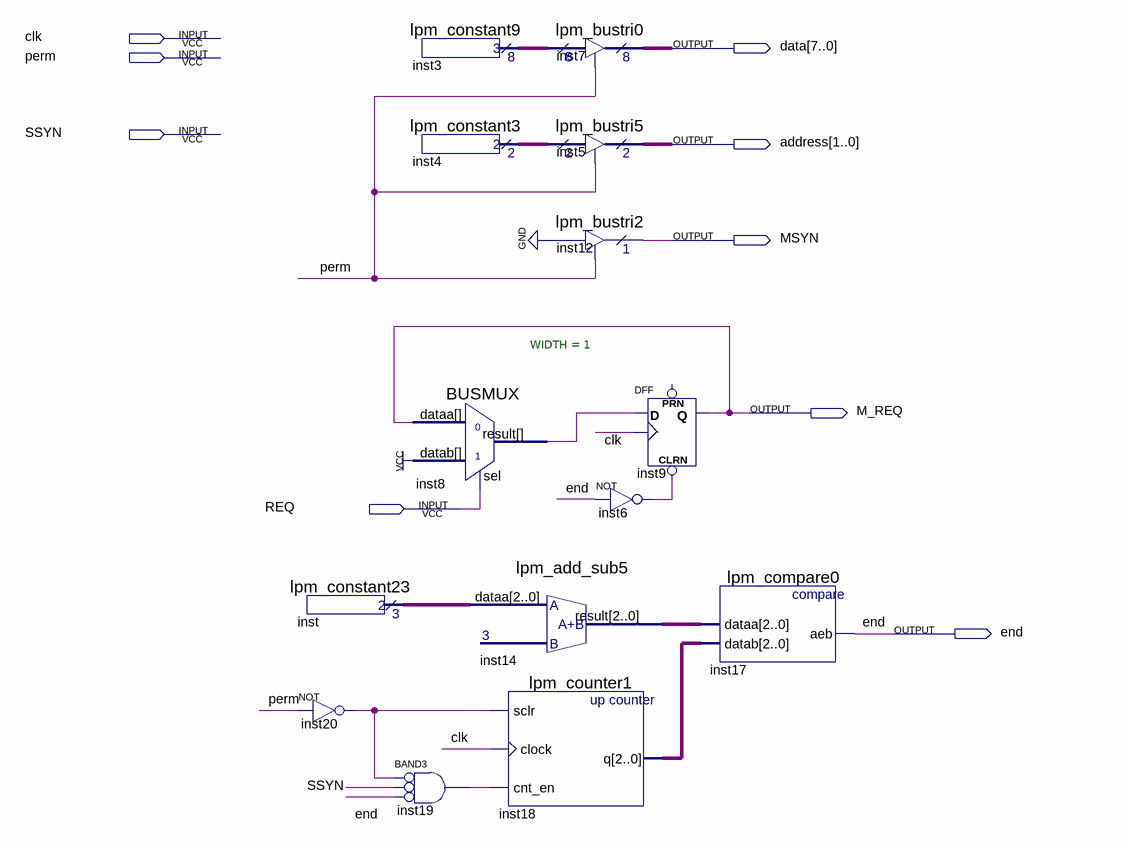
[diagram p0: schematic sheet]
// Quartus schematic Master3.bdf as structural Verilog: 14 symbols, 9 pins
module Master3 (
  input  clk,
  input  perm,
  input  SSYN,
  input  REQ,
  output [7:0] data,
  output [1:0] address,
  output MSYN,
  output M_REQ,
  output \end 
);

  wire inst6_out, inst8_result, inst19_out, inst20_out;
  wire [1:0] inst4_result;
  wire [2:0] inst14_result, inst18_q, inst_result;
  wire [7:0] inst3_result;

  lpm_constant23 inst (.result(inst_result));
  not inst20 (inst20_out, perm);
  lpm_constant9 inst3 (.result(inst3_result));
  lpm_constant3 inst4 (.result(inst4_result));
  BUSMUX #(.WIDTH(1)) inst8 (.datab(1'b1), .sel(REQ), .dataa(M_REQ), .result(inst8_result));
  and inst19 (inst19_out, ~inst20_out, ~SSYN, ~\end );  // BAND3
  lpm_add_sub5 inst14 (.dataa(inst_result), .result(inst14_result));
  lpm_counter1 inst18 (.sclr(inst20_out), .clock(clk), .cnt_en(inst19_out), .q(inst18_q));
  lpm_bustri0 inst7 (.enabledt(perm), .data(inst3_result), .tridata(data));
  lpm_bustri5 inst5 (.enabledt(perm), .data(inst4_result), .tridata(address));
  lpm_bustri2 inst12 (.enabledt(perm), .data(1'b0), .tridata(MSYN));
  DFF inst9 (.CLRN(inst6_out), .CLK(clk), .D(inst8_result), .Q(M_REQ));  // open: PRN
  not inst6 (inst6_out, \end );
  lpm_compare0 inst17 (.dataa(inst14_result), .datab(inst18_q), .aeb(\end ));
endmodule
